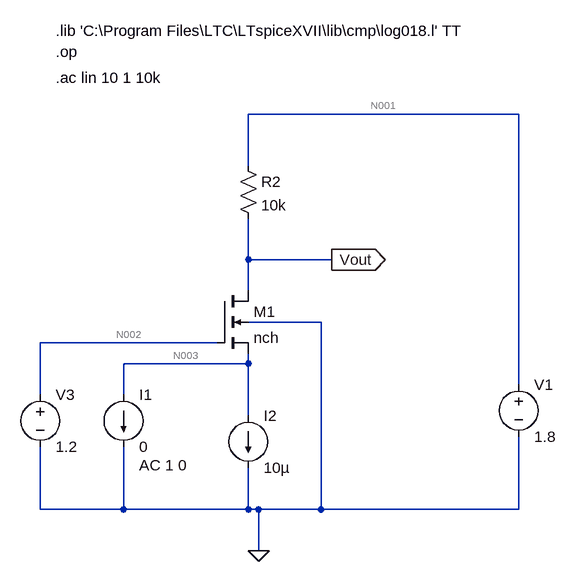
[diagram p0: schematic Week 3 Exc2.asc]
Week 3 Exc2.asc, the LTspice schematic file:
Version 4
SHEET 1 880 680
WIRE 672 -144 256 -144
WIRE 256 -64 256 -144
WIRE 256 80 256 16
WIRE 384 80 256 80
WIRE 256 128 256 80
WIRE 368 176 256 176
WIRE 208 208 -64 208
WIRE 256 240 256 224
WIRE 256 240 64 240
WIRE 672 272 672 -144
WIRE -64 288 -64 208
WIRE 64 288 64 240
WIRE 256 320 256 240
WIRE -64 464 -64 368
WIRE 64 464 64 368
WIRE 64 464 -64 464
WIRE 256 464 256 400
WIRE 256 464 64 464
WIRE 272 464 256 464
WIRE 368 464 368 176
WIRE 368 464 272 464
WIRE 672 464 672 352
WIRE 672 464 368 464
WIRE 272 528 272 464
FLAG 272 528 0
FLAG 384 80 Vout
IOPIN 384 80 Out
SYMBOL nmos4 208 128 R0
SYMATTR InstName M1
SYMATTR Value nch
SYMATTR Value2 l=0.18u w=0.36u
SYMBOL current 64 288 R0
WINDOW 123 24 108 Left 2
WINDOW 39 0 0 Left 0
SYMATTR Value2 AC 1 0
SYMATTR InstName I1
SYMATTR Value 0
SYMBOL voltage -64 272 R0
WINDOW 123 0 0 Left 0
WINDOW 39 0 0 Left 0
SYMATTR InstName V3
SYMATTR Value 1.2
SYMBOL res 240 -80 R0
SYMATTR InstName R2
SYMATTR Value 10k
SYMBOL voltage 672 256 R0
WINDOW 123 0 0 Left 0
WINDOW 39 0 0 Left 0
SYMATTR InstName V1
SYMATTR Value 1.8
SYMBOL current 256 320 R0
WINDOW 123 0 0 Left 0
WINDOW 39 0 0 Left 0
SYMATTR InstName I2
SYMATTR Value 10µ
TEXT -40 -272 Left 2 !.lib 'C:\\Program Files\\LTC\\LTspiceXVII\\lib\\cmp\\log018.l' TT
TEXT -40 -240 Left 2 !.op
TEXT -40 -200 Left 2 !.ac lin 10 1 10k

The netlist it stands for:
* Week 3 Exc2.asc
M1 Vout N002 N003 0 nch l=0.18u w=0.36u
I1 N003 0 0 AC 1 0
V3 N002 0 1.2
R2 N001 Vout 10k
V1 N001 0 1.8
I2 N003 0 10µ
.model NMOS NMOS
.model PMOS PMOS
.lib standard.mos
.lib 'C:\Program Files\LTC\LTspiceXVII\lib\cmp\log018.l' TT
.op
.ac lin 10 1 10k
.backanno
.end

* Results of the author's LTspice run, read from the files saved beside the schematic
* Operating Point, zero values left out:
*   V(vout) = 1.7 V
*   V(n002) = 1.2 V
*   V(n003) = 478.6 mV
*   V(n001) = 1.8 V
*   Id(M1) = 10 µA
*   Ib(M1) = -131.7 pA
*   Is(M1) = -10 µA
*   I(I2) = 10 µA
*   I(R2) = 10 µA
*   I(V1) = -10 µA
* From the log:
*   Semiconductor Device Operating Points:
*                           --- BSIM3 MOSFETS ---
*   Name:        m1
*   Model:     nch.12
*   Id:        1.00e-05
*   Vgs:       7.21e-01
*   Vds:       1.22e+00
*   Vbs:      -4.79e-01
*   Vth:       6.19e-01
*   Vdsat:     1.23e-01
*   Gm:        1.02e-04
*   Gds:       2.59e-06
*   Gmb        2.04e-05
*   Cbd:       0.00e+00
*   Cbs:       0.00e+00
*   Cgsov:     1.25e-16
*   Cgdov:     1.25e-16
*   Cgbov:     3.18e-17
*   dQgdVgb:   6.41e-16
*   dQgdVdb:  -1.23e-16
*   dQgdVsb:  -4.25e-16
*   dQddVgb:  -1.25e-16
*   dQddVdb:   1.25e-16
*   dQddVsb:   1.39e-19
*   dQbdVgb:  -9.94e-17
*   dQbdVdb:   2.72e-19
*   dQbdVsb:  -5.20e-17